# EAGLE design WaterDrop (EAGLE 6.1)
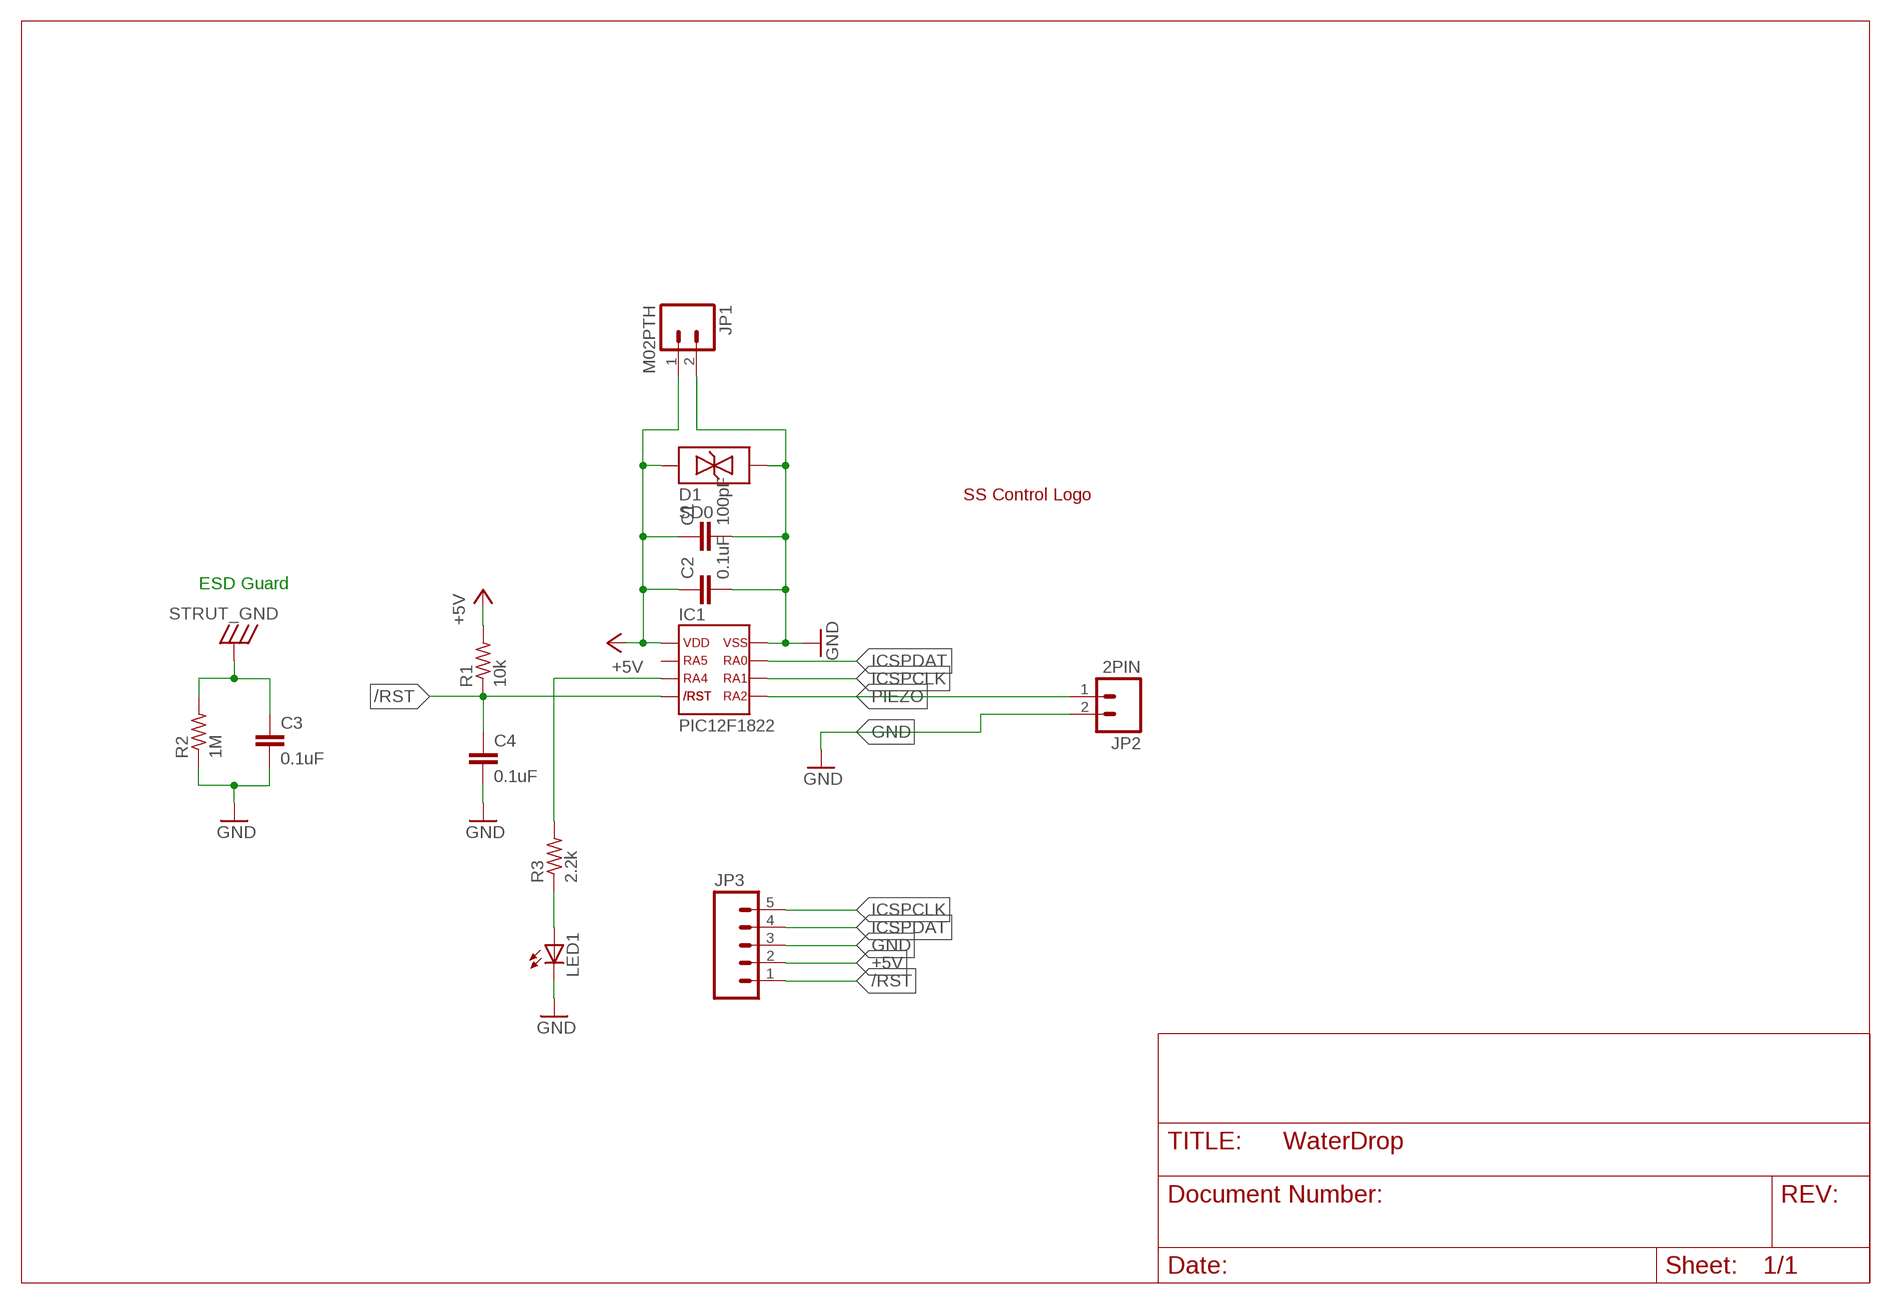
[diagram p0: schematic, sheet 1]

## Parts
C1  100pF  C0603(1608)  [C0603(1608)]
C2  0.1uF  C0603(1608)  [C0603(1608)]
C3  0.1uF  C0603(1608)  [C0603(1608)]
C4  0.1uF  C0603(1608)  [C0603(1608)]
D1  SD0  [SOD-323]
IC1  PIC12F1822  [SO8]
JP1  M02PTH  [1X02]
JP2  2PIN  [2PIN5.08]
JP3  M05PTH  [1X05]
LED1  LED0603  [LED-0603]
R1  10k  R0603(1608)  [R0603(1608)]
R2  1M  R0603(1608)  [R0603(1608)]
R3  2.2k  R0603(1608)  [R0603(1608)]
U$1  LOGOPIEZO  [SSPIEZOLOGO]

## Nets
+5V: C1.1 C2.1 D1.1 IC1.1 JP1.1 JP3.2 R1.2
/RST: C4.1 IC1.4 JP3.1 R1.1
GND: C1.2 C2.2 C3.2 C4.2 D1.2 IC1.8 JP1.2 JP2.2 JP3.3 LED1.C R2.1
ICSPCLK: IC1.6 JP3.5
ICSPDAT: IC1.7 JP3.4
N$2: LED1.A R3.1
N$3: IC1.3 R3.2
PIEZO: IC1.5 JP2.1
STRUT_GND: C3.1 R2.2
Unconnected: IC1.2

## Notes on the sheet
- ESD Guard

## Library data of the parts
C1-C4 = WaterDrop:C
D1 = WaterDrop:SD0
IC1 = WaterDrop:PIC12F1822
JP1 = SparkFun-Connectors:M02: Standard 2-pin 0.1" header. Use with - straight break away headers ( PRT-00116) - right angle break away headers (PRT-00553) - swiss pins (PRT-00743) - machine pins (PRT-00117) - female headers (PRT-00115) Molex polarized connector foot print use with: PRT-08233 with associated crimp pins and housings. 2.54_SCREWTERM for use with PRT-10571. 3.5mm Screw Terminal footprints for PRT-08084 5mm Screw Terminal footprints for use with PRT-08433
JP2 = WaterDrop:2PIN
JP3 = SparkFun-Connectors:M05: Header 5 Standard 5-pin 0.1" header. Use with straight break away headers (SKU : PRT-00116), right angle break away headers (PRT-00553), swiss pins (PRT-00743), machine pins (PRT-00117), and female headers (PRT-00115). Molex polarized connector foot print use with SKU : PRT-08230 with associated crimp pins and housings.
LED1 = SparkFun:LED: LEDs Standard schematic elements and footprints for 5mm, 3mm, 1206, and 0603 sized LEDs. 5mm - Spark Fun Electronics SKU : COM-00529 (and others)
R1-R3 = WaterDrop:R
U$1 = WaterDrop:LOGO

## Board
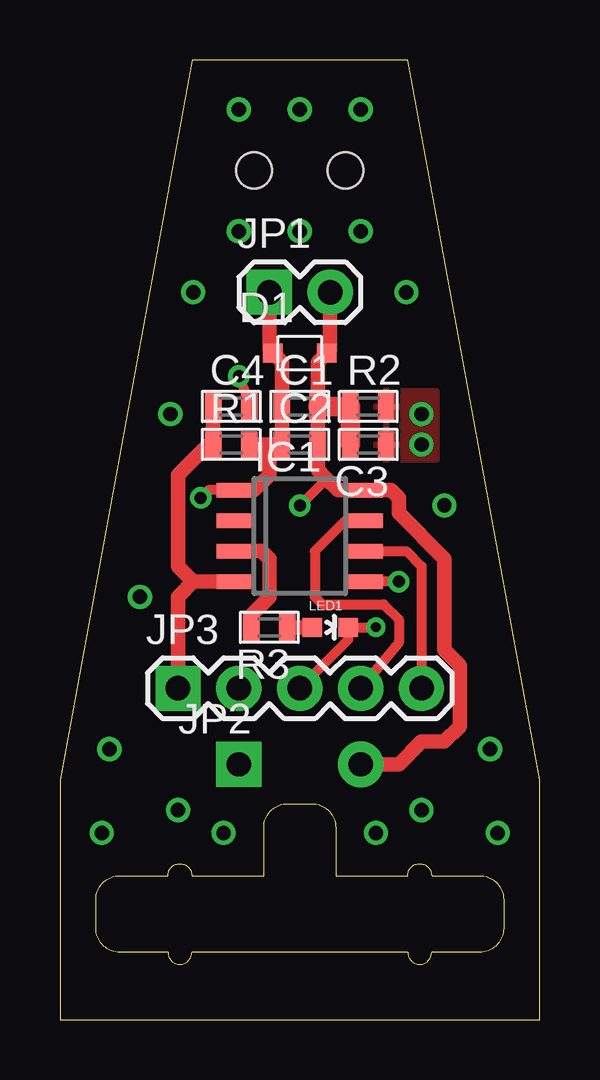
[diagram p1: board, top side]
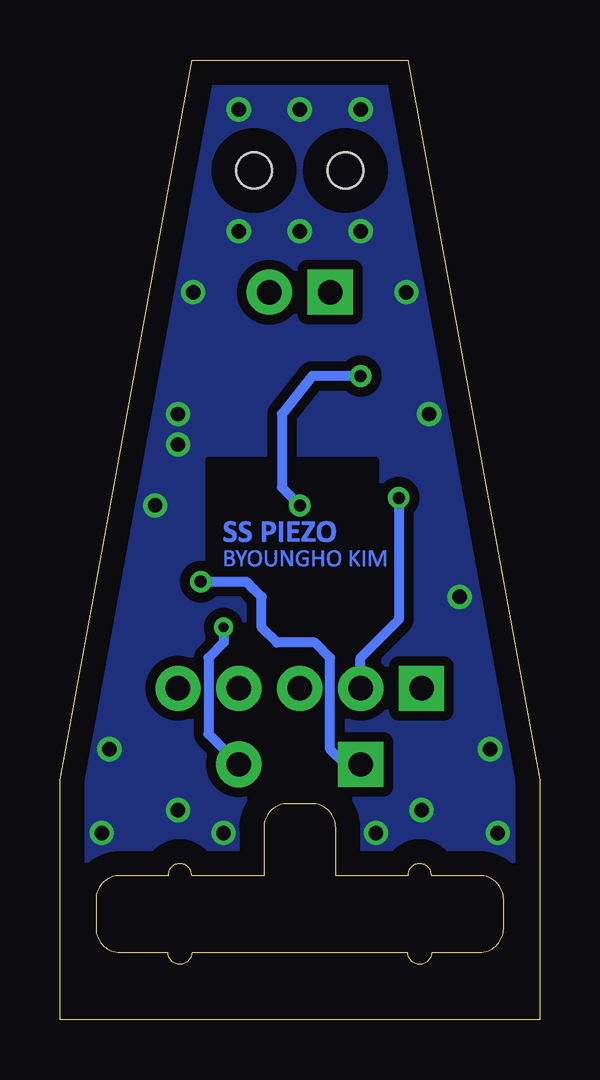
[diagram p2: board, bottom side, seen from below]

Size 20 x 40 mm. Coordinates in mm from the lower left corner, seen from the top.
Outline: 20,10 14.5,40 5.5,40 0,10 0,0 20,0 20,10
Outline: 11.5,6 14.5,6 arc-180 15.5,6 17.5,6 arc-90 18.5,5 18.5,3.8 arc-90 17.5,2.8 15.5,2.8 arc-180 14.5,2.8 5.5,2.8 arc-180 4.5,2.8 2.5,2.8 arc-90 1.5,3.8 1.5,5 arc-90 2.5,6 4.5,6 arc-180 5.5,6 8.5,6 8.5,8 arc-90 9.5,9 10.5,9 arc-90 11.5,8 11.5,6
Copper layers (1*16): Top 0.035mm / dielectric 1.5mm / Bottom 0.035mm
Design rules: minimum track width 10mil, minimum drill 24mil, track to track 8mil, track to pad 8mil, pad to pad 8mil, via to via 8mil, smd to smd 8mil, copper to edge 40mil, drill to drill 8mil, minimum pad ring 10mil, minimum via ring 8mil, stop-mask expansion 4mil, vias tented up to drill 0mil, thermal gap 10mil
Holes 1.5 mm at 8.1,35.4 11.9,35.4

### Footprints (pad centres in the part's own frame; a part is rotated, then mirrored left to right if it is on the bottom)
C0603(1608) = smd 0.7 x 1.1: 1 -0.75,0; 2 0.75,0
SOD-323 = smd 0.8 x 0.8: 1 -1.125,0; 2 1.125,0
SO8 = smd 0.6 x 1.55: 1 -1.905,-2.7; 2 -0.635,-2.7; 3 0.635,-2.7; 4 1.905,-2.7; 5 1.905,2.7; 6 0.635,2.7; 7 -0.635,2.7; 8 -1.905,2.7
1X02 = drill 1.016 pad 1.88 square: 1 0,0 | drill 1.016 pad 1.88: 2 2.54,0
2PIN5.08 = drill 1.016 pad 1.88 square: 1 -2.54,0 | drill 1.016 pad 1.905: 2 2.54,0
1X05 = drill 1.016 pad 1.88 square: 1 0,0 | drill 1.016 pad 1.88: 2 2.54,0; 3 5.08,0; 4 7.62,0; 5 10.16,0
LED-0603 = smd 0.8 x 0.8: A 0,-0.75; C 0,0.75
R0603(1608) = smd 0.7 x 1.1: 1 -0.75,0; 2 0.75,0

### Placement (x,y rotation side)
C1  10,25.56 0 top
C2  10,23.97 0 top
C3  12.86,23.97 180 top
C4  7.14,25.56 0 top
D1  10,27.78 0 top
IC1  10,20.16 270 top
JP1  8.73,30.32 0 top
JP2  10,10.63 0 top
JP3  4.92,13.81 0 top
LED1  11.27,16.35 270 top
R1  7.14,23.97 0 top
R2  12.86,25.56 0 top
R3  8.73,16.35 180 top
U$1  13.18,18.89 0 bottom

### Tracks (layer width: path | path; a pad name or v marks a point on that pad's centre or on a via)
+5V  (via drill 0.5)
  Top 0.406: IC1.1 6.19,22.06 v5.87,21.75
  Top 0.61: R1.2 8.73,23.97 | 8.73,23.97 C2.1 C1.1 9.25,27.41 D1.1 8.73,27.93 JP1.1 | IC1.1 8.1,22.06 8.73,22.7 8.73,23.97
  Bottom 0.406: v5.87,21.75 5.87,16.67 6.19,16.35 7.46,15.08 JP3.2
/RST
  Top 0.61: C4.1 R1.1 6.19,23.97 4.92,22.7 4.92,20.16 4.92,18.89 5.55,18.26 | 5.55,18.26 IC1.4 5.55,18.26 | 5.55,18.26 4.92,17.62 JP3.1
GND  (via drill 0.4, 0.5)
  Top 0.406: v13.18,16.35 LED1.C 12.02,15.83 11.27,15.08 JP3.3 | C4.2 7.89,25.76 v7.46,26.83 | v10,21.43 11.11,22.54
  Top 0.61: JP1.2 11.27,27.93 D1.2 10.75,27.41 C1.2 C2.2 10.75,22.9 11.11,22.54 11.59,22.06 | 11.59,22.06 IC1.8 | 11.59,22.06 13.81,22.06 14.13,21.75 14.13,21.11 16.03,19.21 16.03,15.4 16.19,15.24 16.67,14.76 16.67,12.22 16.03,11.59 15.08,11.59 14.13,10.63 JP2.2
  Top 0.813: C3.2 R2.1 C1.2
  Bottom 0.406: v13.18,16.35 13.18,15.71 13.81,15.08 13.81,11.9 JP2.2 | v7.46,26.83 9.48,26.83 10.75,25.24 10.75,22.18 v10,21.43
ICSPCLK
  Top 0.406: IC1.6 14.45,19.52 15.08,18.89 JP3.5
ICSPDAT
  Top 0.406: IC1.7 11.9,20.8 11.27,20.16 10.63,19.52 10.63,17.62 10.95,17.3 13.49,17.3 14.13,16.67 14.13,15.71 JP3.4
N$1
  cutout Bottom: 6.83,23.34 6.83,16.35 10.32,16.35 10.95,16.98 10.95,18.26 11.59,18.89 13.81,18.89 13.81,23.34
N$2
  Top 0.61: LED1.A R3.1
N$3
  Top 0.61: IC1.3 8.41,19.52 8.73,19.21 8.73,17.62 7.98,16.87 R3.2
PIEZO  (via drill 0.5)
  Top 0.406: v14.13,18.26 IC1.5
  Bottom 0.406: JP2.1 8.1,10.63 8.73,11.27 8.73,15.08 9.37,15.71 10.95,15.71 11.59,16.35 11.59,17.62 11.9,17.94 12.22,18.26 v14.13,18.26
STRUT_GND  (via drill 0.6)
  other vias: 15.08,25.24 15.08,23.97 13.18,7.78 6.83,7.78 7.46,32.86 12.54,32.86 10,32.86 15.08,8.73 4.92,8.73 7.46,37.94 10,37.94 12.54,37.94 1.74,7.78 18.26,7.78 4.6,25.24 3.33,17.62 16.03,21.43 5.55,30.32 14.45,30.32 2.06,11.27 17.94,11.27
  pour Bottom (isolate 0.406): 4.92,40.48 15.08,40.48 20.16,10 20.16,-0.62 -0.16,-0.62 -0.16,10
  pour Top: 13.18,26.19 13.18,23.34 15.71,23.34 15.71,26.19